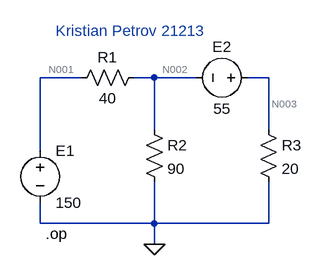
[diagram p0: schematic Draft2.asc]
Draft2.asc, the LTspice schematic file:
Version 4
SHEET 1 880 680
WIRE 112 64 48 64
WIRE 224 64 192 64
WIRE 288 64 224 64
WIRE 400 64 368 64
WIRE 224 144 224 64
WIRE 400 144 400 64
WIRE 48 176 48 64
WIRE 48 288 48 256
WIRE 224 288 224 224
WIRE 224 288 48 288
WIRE 400 288 400 224
WIRE 400 288 224 288
WIRE 224 320 224 288
FLAG 224 320 0
DATAFLAG 64 64 ""
DATAFLAG 192 288 ""
DATAFLAG 352 288 ""
DATAFLAG 240 64 ""
DATAFLAG 400 64 ""
SYMBOL voltage 48 160 R0
WINDOW 123 0 0 Left 0
WINDOW 39 0 0 Left 0
SYMATTR InstName E1
SYMATTR Value 150
SYMBOL voltage 384 64 R90
WINDOW 0 -32 56 VBottom 2
WINDOW 3 32 56 VTop 2
WINDOW 123 0 0 Left 0
WINDOW 39 0 0 Left 0
SYMATTR InstName E2
SYMATTR Value 55
SYMBOL res 96 80 R270
WINDOW 0 32 56 VTop 2
WINDOW 3 0 56 VBottom 2
SYMATTR InstName R1
SYMATTR Value 40
SYMBOL res 384 128 R0
SYMATTR InstName R3
SYMATTR Value 20
SYMBOL res 208 128 R0
SYMATTR InstName R2
SYMATTR Value 90
TEXT 56 304 Left 2 !.op
TEXT 72 -8 Left 2 ;Kristian Petrov 21213

The netlist it stands for:
* Draft2.asc
V§E1 N001 0 150
V§E2 N003 N002 55
R1 N001 N002 40
R3 N003 0 20
R2 N002 0 90
.op
* Kristian Petrov 21213
.backanno
.end

* Results of the author's LTspice run, read from the files saved beside the schematic
* Operating Point:
*   V(n001) = 150 V
*   V(n003) = 66.61 V
*   V(n002) = 11.61 V
*   I(R1) = 3.46 A
*   I(R3) = 3.331 A
*   I(R2) = 129 mA
*   I(E1) = -3.46 A
*   I(E2) = -3.331 A